# Altium project FLETCHER v2.PrjPcb
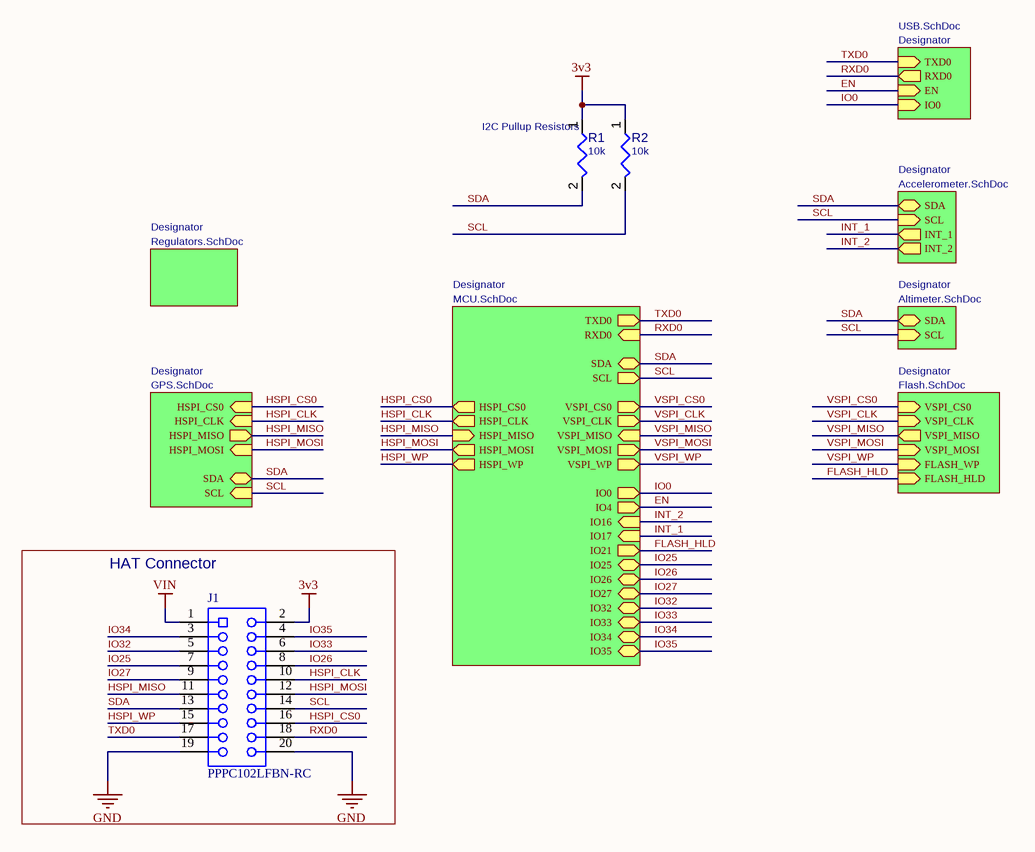
[diagram p0: Top Level.SchDoc]
CAGE_CODE: ?????; CONTRACT_NUMBER: <CONTRACT NO>; DOC_NO_ASSY_DWG: <ASSY DWG NO>; DOC_NO_BOM: <BOM DOC NO>; DOC_NO_FAB_DWG: <FAB DWG NO>; DOC_NO_SCH_DWG: <SCH DWG NO>; PCB_2_DEC_TOL: +/-.01; PCB_3_DEC_TOL: +/-.010; PCB_ANG_TOL: +/-1/2; PCB_ASSEMBLY_NO: <PCB ASSY NO>; PCB_CHECKER: - -----; PCB_CHECKER_APP_DATE: --/--/----; PCB_DESIGNER: - -----; PCB_DESIGNER_APP_DATE: --/--/----; PCB_DWG_NO: <PCB DWG NO>; PCB_ENGINEER: - -----; PCB_ENGINEER_APP_DATE: --/--/----; PCB_PART_NUMBER: <PCB PN>; PCB_REV: A; SCH_REV: A
8 sheets, 83 parts. Net scope: hierarchical (ports join the sheet entries above them; power ports are global).
Board file: PCB1.PcbDoc
Sheets:
  Top Level.SchDoc
    Designator = USB.SchDoc
    Designator = Flash.SchDoc
    Designator = MCU.SchDoc
    Designator = Accelerometer.SchDoc
    Designator = GPS.SchDoc
    Designator = Altimeter.SchDoc
    Designator = Regulators.SchDoc

## Sheet Top Level.SchDoc
size B; SheetNumber: 1; SheetTotal: 8

### Parts
J1  PPPC102LFBN-RC  [SLIN-PPPC102LFBN-RC_V]
R1  value 10k  [RESC0402(1005)_L]  (hidden comment: Resistor 10K  +/-1 % 0402 63 mW)
R2  value 10k  [RESC0402(1005)_L]  (hidden comment: Resistor 10K  +/-1 % 0402 63 mW)

### Blocks framed on the sheet
HAT Connector: J1

### Sub-sheets
Designator = USB.SchDoc: TXD0 (in), RXD0 (out), EN (in), IO0 (in)
Designator = Flash.SchDoc: VSPI_CS0 (in), VSPI_CLK (in), FLASH_HLD (in), VSPI_MISO (out), VSPI_MOSI (in), FLASH_WP (in)
Designator = MCU.SchDoc: TXD0 (out), RXD0 (in), SDA (bidir), SCL (out), VSPI_CS0 (out), VSPI_CLK (out), VSPI_MISO (in), VSPI_MOSI (out), VSPI_WP (out), HSPI_WP (out), HSPI_CLK (out), HSPI_CS0 (out), HSPI_MISO (in), HSPI_MOSI (out), IO0 (out), IO4 (out), IO16 (in), IO17 (in), IO21 (out), IO25 (bidir), IO26 (bidir), IO27 (bidir), IO32 (bidir), IO33 (bidir), IO34 (bidir), IO35 (bidir)
Designator = Accelerometer.SchDoc: SDA (bidir), SCL (in), INT_1 (out), INT_2 (out)
Designator = GPS.SchDoc: HSPI_CS0 (in), HSPI_CLK (in), HSPI_MISO (out), HSPI_MOSI (in), SDA (bidir), SCL (in)
Designator = Altimeter.SchDoc: SDA (bidir), SCL (in)
Designator = Regulators.SchDoc: no entries

### Nets
3v3: J1.2 R1.1 R2.1
GND: J1.19 J1.20
VIN: J1.1
EN: sheet Designator/EN, sheet Designator/IO4
FLASH_HLD: sheet Designator/FLASH_HLD, sheet Designator/IO21
HSPI_CLK: J1.10 ; sheet Designator/HSPI_CLK, sheet Designator/HSPI_CLK
HSPI_CS0: J1.16 ; sheet Designator/HSPI_CS0, sheet Designator/HSPI_CS0
HSPI_MISO: J1.11 ; sheet Designator/HSPI_MISO, sheet Designator/HSPI_MISO
HSPI_MOSI: J1.12 ; sheet Designator/HSPI_MOSI, sheet Designator/HSPI_MOSI
HSPI_WP: J1.15 ; sheet Designator/HSPI_WP
INT_1: sheet Designator/IO17, sheet Designator/INT_1
INT_2: sheet Designator/IO16, sheet Designator/INT_2
IO0: sheet Designator/IO0, sheet Designator/IO0
IO25: J1.7 ; sheet Designator/IO25
IO26: J1.8 ; sheet Designator/IO26
IO27: J1.9 ; sheet Designator/IO27
IO32: J1.5 ; sheet Designator/IO32
IO33: J1.6 ; sheet Designator/IO33
IO34: J1.3 ; sheet Designator/IO34
IO35: J1.4 ; sheet Designator/IO35
RXD0: J1.18 ; sheet Designator/RXD0, sheet Designator/RXD0
SCL: J1.14 R2.2 ; sheet Designator/SCL, sheet Designator/SCL, sheet Designator/SCL, sheet Designator/SCL
SDA: J1.13 R1.2 ; sheet Designator/SDA, sheet Designator/SDA, sheet Designator/SDA, sheet Designator/SDA
TXD0: J1.17 ; sheet Designator/TXD0, sheet Designator/TXD0
VSPI_CLK: sheet Designator/VSPI_CLK, sheet Designator/VSPI_CLK
VSPI_CS0: sheet Designator/VSPI_CS0, sheet Designator/VSPI_CS0
VSPI_MISO: sheet Designator/VSPI_MISO, sheet Designator/VSPI_MISO
VSPI_MOSI: sheet Designator/VSPI_MOSI, sheet Designator/VSPI_MOSI
VSPI_WP: sheet Designator/FLASH_WP, sheet Designator/VSPI_WP

### Notes on the sheet
- (near R1) I2C Pullup Resistors

### Library data of the parts
J1 = CMP-002-00029-1: Female Header, Pitch 2.54 mm, 2 x 10 Position, Height 8.75 mm, Tail Length 3.2 mm, -40 to 105 degC, RoHS, Bulk; Manufacturer: Sullins; Mounting Technology: TH; Gender: Female; Datasheet URL: http://datasheet.octopart.com/PPPC102LFBN-RC-Sullins-datasheet-8327184.pdf; Max Operating Temperature: 105°C; Package Description: Female Header, Pitch 2.54 mm, 2 x 10 Position, Height 8.75 mm, Tail Length 3.2 mm; Min Operating Temperature: -40°C; Datasheet Version: Rev. D, 10/2007; Case/Package: PPPC102LFBN-RC; Connector Type: Header; RoHS Compliant: Unknown; Package Reference: PPPC102LFBN-RC
R1 R2 = CMP-009-00149-2: Chip Resistor, 10 kOhms, +/-1 %, 63 mW, -55 to 125 degC, 0402; Power: 63mW; Tolerance: 1%; Pins: 2; Max Operating Temperature: 155°C; Min Operating Temperature: -55°C; Case/Package: 0402
  R1: JLCPCB Part #: C25744

## Sheet USB.SchDoc
size B; SheetNumber: 3; SheetTotal: 8
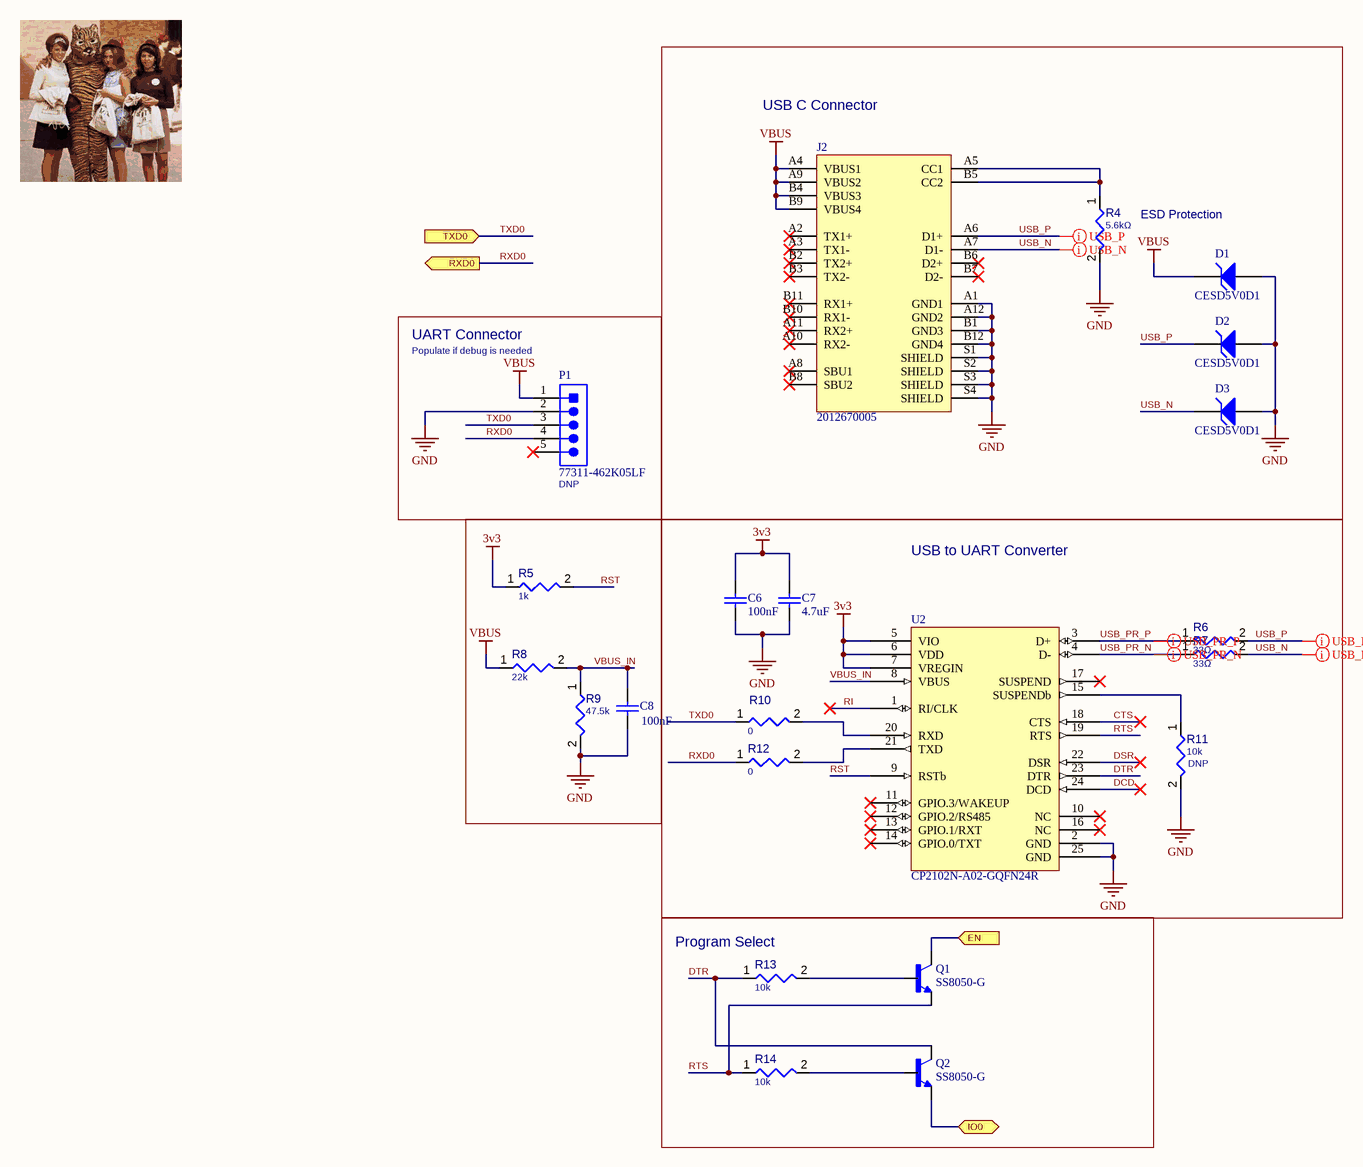
[diagram p1: USB.SchDoc]

### Parts
C6  Capacitance: 100nF  [Capacitor_0402]  (hidden comment: GRM155R71E104KE14D)
C7  Capacitance: 4.7uF  [Capacitor_0402]  (hidden comment: GRM155R60J475ME87D)
C8  Capacitance: 100nF  [Capacitor_0402]  (hidden comment: GRM155R71E104KE14D)
D1  CESD5V0D1  [JSCJ-SOD-123-2_V]
D2  CESD5V0D1  [JSCJ-SOD-123-2_V]
D3  CESD5V0D1  [JSCJ-SOD-123-2_V]
J2  2012670005  [2012670005-Footprint-1]
P1  77311-462K05LF  [FCI-77311-5_V]
Q1  SS8050-G  [SS8050-G-Footprint-1]
Q2  SS8050-G  [SS8050-G-Footprint-1]
R4  value 5.6kΩ  [RESC0402(1005)_L]  (hidden comment: 5D6KR2J)
R5  value 1k  [RESC0402(1005)_L]  (hidden comment: Resistor 1K +/-5 % 0402 63 mW)
R6  value 33Ω  [RESC0402(1005)_L]  (hidden comment: 33R2J)
R7  value 33Ω  [RESC0402(1005)_L]  (hidden comment: 33R2J)
R8  value 22k  [RESC0402(1005)_L]  (hidden comment: Resistor 22K  +/-1 % 0402 63 mW)
R9  value 47.5k  [RESC0402(1005)_L]  (hidden comment: Resistor 47K5 +/-1 % 0402 63 mW)
R10  value 0  [RESC0402(1005)_L]  (hidden comment: Jumper 0402)
R11  value 10k  [RESC0402(1005)_L]  (hidden comment: Resistor 10K  +/-1 % 0402 63 mW)
R12  value 0  [RESC0402(1005)_L]  (hidden comment: Jumper 0402)
R13  value 10k  [RESC0402(1005)_L]  (hidden comment: Resistor 10K  +/-1 % 0402 63 mW)
R14  value 10k  [RESC0402(1005)_L]  (hidden comment: Resistor 10K  +/-1 % 0402 63 mW)
U2  CP2102N-A02-GQFN24R  [CP2102N-A02-GQFN24R-Footprint-1]

### Blocks framed on the sheet
USB C Connector: D1-D3 J2 R4
UART Connector: P1
USB to UART Converter: C6 C7 R6 R7 R10-R12 U2
Program Select: Q1 Q2 R13 R14

### Ports
EN (in), IO0 (bidir), RXD0 (out), TXD0 (in)

### Nets
3v3: C6.2 C7.2 R5.1 U2.5(VIO) U2.6(VDD) U2.7(VREGIN)
GND: C6.1 C7.1 C8.1 D1.1(A) D2.1(A) D3.1(A) J2.A1(GND1) J2.A12(GND2) J2.B1(GND3) J2.B12(GND4) J2.S1(SHIELD) J2.S2(SHIELD) J2.S3(SHIELD) J2.S4(SHIELD) P1.2(RXI) R4.2 R9.2 R11.2 U2.2(GND) U2.25(GND)
VBUS: D1.2(K) J2.A4(VBUS1) J2.A9(VBUS2) J2.B4(VBUS3) J2.B9(VBUS4) P1.1(DTR) R8.1
CTS: U2.18(CTS)
DCD: U2.24(DCD)
DSR: U2.22(DSR)
DTR: Q2.3(C) R13.1 U2.23(DTR)
EN: Q1.3(C) ; port EN
IO0: Q2.2(E) ; port IO0
RI: U2.1(RI/CLK)
RST: R5.2 U2.9(RSTb)
RTS: Q1.2(E) R14.1 U2.19(RTS)
RXD0: P1.4(VCC) R12.1 ; port RXD0
TXD0: P1.3(TXO) R10.1 ; port TXD0
USB_N: D3.2(K) J2.A7(D1-) R7.2
USB_P: D2.2(K) J2.A6(D1+) R6.2
USB_PR_N: R7.1 U2.4(D-)
USB_PR_P: R6.1 U2.3(D+)
VBUS_IN: C8.2 R8.2 R9.1 U2.8(VBUS)
NetJ2_A5: J2.A5(CC1) J2.B5(CC2) R4.1
NetQ1_1: Q1.1(B) R13.2
NetQ2_1: Q2.1(B) R14.2
NetR10_2: R10.2 U2.20(RXD)
NetR11_1: R11.1 U2.15(SUSPENDb)
NetR12_2: R12.2 U2.21(TXD)

Not connected (* = marked no-connect by the designer): J2 A2(TX1+)* A3(TX1-)* A8(SBU1)* A10(RX2-)* A11(RX2+)* B2(TX2+)* B3(TX2-)* B6(D2+)* B7(D2-)* B8(SBU2)* B10(RX1-)* B11(RX1+)*; P1 5(CTS)*; U2 10(NC)* 11(GPIO.3/WAKEUP)* 12(GPIO.2/RS485)* 13(GPIO.1/RXT)* 14(GPIO.0/TXT)* 16(NC)* 17(SUSPEND)*

### Layout directives
differential pair; net class USB: USB_N, USB_P, USB_PR_N, USB_PR_P

### Notes on the sheet
- ESD Protection
- (near P1) Populate if debug is needed

### Library data of the parts
C6 C8 = CMP-001-00084-3: Chip Capacitor 100nF 0402 25V X7R
C7 = CMP-00000-1: 6.3V 4.7uF X5R ±20% 0402 Multilayer Ceramic Capacitors MLCC - SMD/SMT ROHS; Thickness: 0.022inch; Min Operating Temperature: -55°C; Case Code (Metric): 1005; Depth: 0.5mm; Tolerance: 20%; Width: 0.02inch; Series: GRM; Length: 1mm; Height: 0.5mm; Lead Free: Lead Free; Dielectric: X5R; Construction: Flat; REACH SVHC: No SVHC; Mount: Surface Mount; Radiation Hardening: No; Voltage Rating: 6.3V; RoHS Compliant: Yes; Packaging: Tape and Reel; Voltage Rating (DC): 6.3V; Package Quantity: 1; Max Operating Temperature: 85°C; Case Code (Imperial): 0402; JLCPCB Part #: C23733
D1-D3 = CMP-004-00020-1: Uni-driection ESD Protection Diode, 5 V, 1 uA, 2-Pin SOD-123, RoHS, Tape and Reel; Manufacturer: Jiangsu Changjiang Electronics Technology; Mounting Technology: SM; Case/Package: SOD-123-2; Package Description: 2-Pin Surface Mount Device, Body 2.7 x 1.6 mm; Package Reference: SOD-123-2; RoHS Compliant: Unknown; Package URL: http://www.cj-elec.com/txUpfile/201412112231195145.pdf; Datasheet URL: http://www.cj-elec.com/gallery/txUpfile/f05a5831e2d7f622a930855050fbe076.pdf; Datasheet Version: Rev. B, 04/2014
  D1: JLCPCB Part #: C85649
J2 = CMP-002-00076-2: Conn USB 3.1 Type C F 24 POS 0.5mm Solder RA SMD 24 Terminal 1 Port T/R; JLCPCB Part #: C565324
P1 = CMP-002-00021-1: Male Header, Pitch 2.54 mm, 1 x 5 Position, Height 16.24 mm, Tail Length 3.05 mm, -65 to 125 degC, RoHS, Tape and Reel; Manufacturer: FCI Electronics; Gender: Male; Mounting Technology: TH; Connector Type: Header; Package Reference: 77311-5; Case/Package: 77311-5; RoHS Compliant: Unknown; Datasheet URL: http://portal.fciconnect.com/Comergent//fci/drawing/77311.pdf; Manufacturer URL: http://portal.fciconnect.com/; Package Description: Male Header, Pitch 2.54 mm, 1 x 5 Position, Height 16.24 mm, Tail Length 3.05 mm; Datasheet Version: Rev. CK, 07/2016; DNP: DNP
Q1 Q2 = CMP-013-00035-1: Trans Gp Bjt NPN 25V 1.5A 300MW 3-PIN SOT-23 T/r
  Q1: JLCPCB Part #: C2150
R4 = CMP-009-00108-1: 5K6 0.063W 5% 0402 (1005 Metric)  SMD; Power: 63mW; Mounting Technology: SMT; Pins: 2; Tolerance: 5%; Case/Package: 0402; JLCPCB Part #: C25908
R5 = CMP-009-00157-2: Chip Resistor, 1 kOhms, +/-5 %, 63 mW, -55 to 155 degC, 0402; Power: 63mW; Tolerance: 5%; Min Operating Temperature: -55°C; Max Operating Temperature: 155°C; Pins: 2; Case/Package: 0402; JLCPCB Part #: C11702
R6 R7 = CMP-009-00096-1: 33R 0.063W 5% 0402 (1005 Metric)  SMD; Power: 63mW; Tolerance: 5%; Mounting Technology: SMT; Pins: 2; Case/Package: 0402
  R6: JLCPCB Part #: C25105
R8 = CMP-009-00123-2: Chip Resistor, 22 kOhms, +/-1 %, 63 mW, -55 to 155 degC, 0402; Power: 63mW; Tolerance: 1%; Min Operating Temperature: -55°C; Max Operating Temperature: 155°C; Pins: 2; Case/Package: 0402; JLCPCB Part #: C25768
R9 = CMP-009-00137-2: Chip Resistor, 47,5 kOhms, +/-1 %, 63 mW, -55 to 155 degC, 0402; Tolerance: 1%; Power: 63mW; Pins: 2; Case/Package: 0402; Max Operating Temperature: 155°C; Min Operating Temperature: -55°C; JLCPCB Part #: C227098
R10 R12 = CMP-009-00148-2: Max Operating Temperature: 155°C; Pins: 2; Case/Package: 0402; Min Operating Temperature: -55°C
  R10: JLCPCB Part #: C17168
R11 R13 R14 = CMP-009-00149-2: as R1 on sheet Top Level; Pins: 2; Max Operating Temperature: 155°C; Min Operating Temperature: -55°C; Case/Package: 0402
  R11: DNP: DNP
U2 = CMP-002-00074-1: Full Speed USB to UART Bridge USB 2.0 3.3V T/R Automotive 24-Pin QFN EP

## Sheet Flash.SchDoc
size B; SheetNumber: 4; SheetTotal: 8
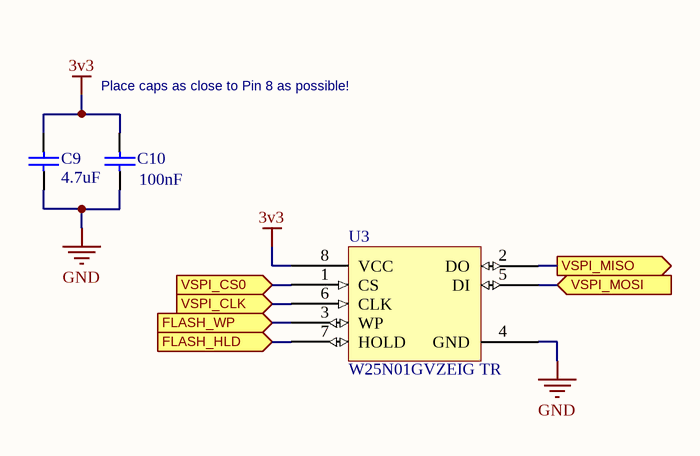
[diagram p2: Flash.SchDoc]

### Parts
C9  Capacitance: 4.7uF  [Capacitor_0402]  (hidden comment: GRM155R60J475ME87D)
C10  Capacitance: 100nF  [Capacitor_0402]  (hidden comment: GRM155R71E104KE14D)
U3  W25N01GVZEIG TR  [W25N01GVZEIG TR-Footprint-1]

### Ports
FLASH_HLD (in), FLASH_WP (in), VSPI_CLK (in), VSPI_CS0 (in), VSPI_MISO (out), VSPI_MOSI (in)

### Nets
3v3: C9.2 C10.2 U3.8(VCC)
GND: C9.1 C10.1 U3.4(GND)
FLASH_HLD: U3.7(HOLD) ; port FLASH_HLD
VSPI_CLK: U3.6(CLK) ; port VSPI_CLK
VSPI_CS0: U3.1(CS) ; port VSPI_CS0
VSPI_MISO: U3.2(DO) ; port VSPI_MISO
VSPI_MOSI: U3.5(DI) ; port VSPI_MOSI
VSPI_WP: U3.3(WP) ; port FLASH_WP

### Notes on the sheet
- Place caps as close to Pin 8 as possible!

### Library data of the parts
C9 = CMP-00000-1: as C7 on sheet USB; Thickness: 0.022inch; Min Operating Temperature: -55°C; Case Code (Metric): 1005; Depth: 0.5mm; Tolerance: 20%; Width: 0.02inch; Series: GRM; Length: 1mm; Height: 0.5mm; Lead Free: Lead Free; Dielectric: X5R; Construction: Flat; REACH SVHC: No SVHC; Mount: Surface Mount; Radiation Hardening: No; Voltage Rating: 6.3V; RoHS Compliant: Yes; Packaging: Tape and Reel; Voltage Rating (DC): 6.3V; Package Quantity: 1; Max Operating Temperature: 85°C; Case Code (Imperial): 0402
C10 = CMP-001-00084-3: Chip Capacitor 100nF 0402 25V X7R
U3 = CMP-010-00028-1: 1Gb NAND Flash Memory With dual/Quad SPI And Continuous Read

## Sheet MCU.SchDoc
size B; SheetNumber: 2; SheetTotal: 8
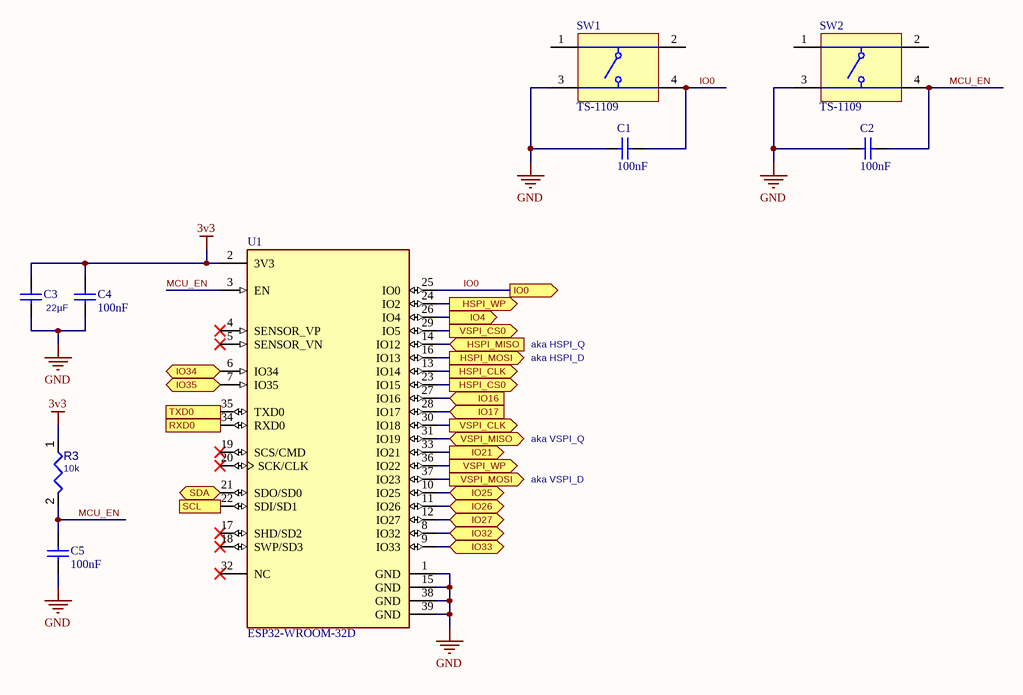
[diagram p3: MCU.SchDoc]

### Parts
C1  Capacitance: 100nF  [Capacitor_0402]  (hidden comment: GRM155R71E104KE14D)
C2  Capacitance: 100nF  [Capacitor_0402]  (hidden comment: GRM155R71E104KE14D)
C3  value 22µF  [Capacitor_0603]  (hidden comment: CL10A226MQ8NRNC)
C4  Capacitance: 100nF  [Capacitor_0402]  (hidden comment: GRM155R71E104KE14D)
C5  Capacitance: 100nF  [Capacitor_0402]  (hidden comment: GRM155R71E104KE14D)
R3  value 10k  [RESC0402(1005)_L]  (hidden comment: Resistor 10K  +/-1 % 0402 63 mW)
SW1  TS-1109  [BEST-TS-1109_V]
SW2  TS-1109  [BEST-TS-1109_V]
U1  ESP32-WROOM-32D  [ESP32-WROOM-32D-Footprint-1]

### Ports
HSPI_CLK (out), HSPI_CS0 (out), HSPI_MISO (in), HSPI_MOSI (out), HSPI_WP (out), IO0 (out), IO4 (out), IO16 (in), IO17 (in), IO21 (out), IO25 (bidir), IO26 (bidir), IO27 (bidir), IO32 (bidir), IO33 (bidir), IO34 (bidir), IO35 (bidir), RXD0 (in), SCL (out), SDA (bidir), TXD0 (out), VSPI_CLK (out), VSPI_CS0 (out), VSPI_MISO (bidir), VSPI_MOSI (out), VSPI_WP (out)

### Nets
3v3: C3.2 C4.2 R3.1 U1.2(3V3)
GND: C1.2 C2.2 C3.1 C4.1 C5.1 SW1.3 SW2.3 U1.1(GND) U1.15(GND) U1.38(GND) U1.39(GND)
EN: U1.26(IO4) ; port IO4
FLASH_HLD: U1.33(IO21) ; port IO21
HSPI_CLK: U1.13(IO14) ; port HSPI_CLK
HSPI_CS0: U1.23(IO15) ; port HSPI_CS0
HSPI_MISO: U1.14(IO12) ; port HSPI_MISO
HSPI_MOSI: U1.16(IO13) ; port HSPI_MOSI
HSPI_WP: U1.24(IO2) ; port HSPI_WP
INT_1: U1.28(IO17) ; port IO17
INT_2: U1.27(IO16) ; port IO16
IO0: C1.1 SW1.4 U1.25(IO0) ; port IO0
IO25: U1.10(IO25) ; port IO25
IO26: U1.11(IO26) ; port IO26
IO27: U1.12(IO27) ; port IO27
IO32: U1.8(IO32) ; port IO32
IO33: U1.9(IO33) ; port IO33
IO34: U1.6(IO34) ; port IO34
IO35: U1.7(IO35) ; port IO35
MCU_EN: C2.1 C5.2 R3.2 SW2.4 U1.3(EN)
RXD0: U1.34(RXD0) ; port RXD0
SCL: U1.22(SDI/SD1) ; port SCL
SDA: U1.21(SDO/SD0) ; port SDA
TXD0: U1.35(TXD0) ; port TXD0
VSPI_CLK: U1.30(IO18) ; port VSPI_CLK
VSPI_CS0: U1.29(IO5) ; port VSPI_CS0
VSPI_MISO: U1.31(IO19) ; port VSPI_MISO
VSPI_MOSI: U1.37(IO23) ; port VSPI_MOSI
VSPI_WP: U1.36(IO22) ; port VSPI_WP

Not connected (* = marked no-connect by the designer): SW1 1 2; SW2 1 2; U1 4(SENSOR_VP)* 5(SENSOR_VN)* 17(SHD/SD2)* 18(SWP/SD3)* 19(SCS/CMD)* 20(SCK/CLK)* 32(NC)*

### Notes on the sheet
- aka HSPI_Q
- aka HSPI_D
- aka VSPI_Q
- aka VSPI_D

### Library data of the parts
C1 C2 C4 C5 = CMP-001-00084-3: Chip Capacitor 100nF 0402 25V X7R
  C1: JLCPCB Part #: C1525
C3 = CMP-001-00086-2: Chip Capacitor 22UF 6.3V X5R 0603; Footprint: 0603; JLCPCB Part #: C59461
R3 = CMP-009-00149-2: as R1 on sheet Top Level; Pins: 2; Max Operating Temperature: 155°C; Min Operating Temperature: -55°C; Case/Package: 0402
SW1 SW2 = CMP-011-00002-2: Tactile Switch, SPST, 12 V, 50 mA, -20 to 80 degC, 4-Pin THD; Manufacturer: Shenzhen Best; Datasheet URL: http://datasheet.octopart.com/TS-1109-Best-Inc.-datasheet-30458100.pdf; RoHS Compliant: Unknown; Case/Package: TS-1109; Datasheet Version: Dec-12; Package Reference: TS-1109; Package Description: 4-Pin Through Hole Device, Body 6.2 x 6.2 mm; Manufacturer URL: www.best-dz.com/; Mounting Technology: TH
U1 = CMP-020-00023-1: Bluetooth, WiFi 802.11b/g/n, Bluetooth v4.2 + EDR, Class 1, 2 and 3 Transceiver Module 2.4GHz ~ 2.5GHz Integrated, Trace Surface Mount

## Sheet Accelerometer.SchDoc
size B; SheetNumber: 6; SheetTotal: 8
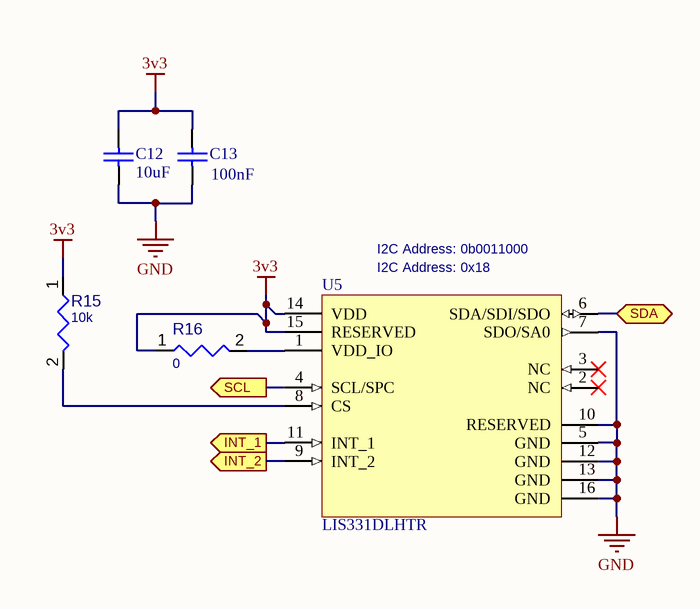
[diagram p4: Accelerometer.SchDoc]

### Parts
C12  Capacitance: 10uF  [Capacitor_0402]  (hidden comment: GRM155R60J106ME44D)
C13  Capacitance: 100nF  [Capacitor_0402]  (hidden comment: GRM155R71E104KE14D)
R15  value 10k  [RESC0402(1005)_L]  (hidden comment: Resistor 10K  +/-1 % 0402 63 mW)
R16  value 0  [RESC0402(1005)_L]  (hidden comment: Jumper 0402)
U5  LIS331DLHTR  [STM-LGA16-3X3X1]

### Ports
INT_1 (out), INT_2 (out), SCL (out), SDA (bidir)

### Nets
3v3: C12.2 C13.2 R15.1 R16.1 U5.14(VDD) U5.15(RESERVED)
GND: C12.1 C13.1 U5.5(GND) U5.7(SDO/SA0) U5.10(RESERVED) U5.12(GND) U5.13(GND) U5.16(GND)
INT_1: U5.11(INT_1) ; port INT_1
INT_2: U5.9(INT_2) ; port INT_2
SCL: U5.4(SCL/SPC) ; port SCL
SDA: U5.6(SDA/SDI/SDO) ; port SDA
NetR15_2: R15.2 U5.8(CS)
NetR16_2: R16.2 U5.1(VDD_IO)

Not connected (* = marked no-connect by the designer): U5 2(NC)* 3(NC)*

### Notes on the sheet
- (near U5) I2C Address: 0b0011000
- (near U5) I2C Address: 0x18

### Library data of the parts
C12 = CMP-00003-1: CAP CER 10UF 6.3V X5R 0402; Tolerance: 20%; Lead Free: Lead Free; Height: 0.5mm; Depth: 0.5mm; Voltage Rating (DC): 6.3V; Case Code (Imperial): 0402; Termination: SMD/SMT; Series: GRM; Case Code (Metric): 1005; Min Operating Temperature: -55°C; Max Operating Temperature: 85°C; RoHS Compliant: Yes; Width: 0.02inch; Voltage Rating: 6.3V; Length: 1mm; Package Quantity: 10000; Thickness: 0.022inch; Packaging: Tape and Reel; Mount: Surface Mount; Dielectric: X5R; REACH SVHC: No SVHC; JLCPCB Part #: C15525
C13 = CMP-001-00084-3: Chip Capacitor 100nF 0402 25V X7R
R15 = CMP-009-00149-2: as R1 on sheet Top Level; Pins: 2; Max Operating Temperature: 155°C; Min Operating Temperature: -55°C; Case/Package: 0402
R16 = CMP-009-00148-2: Max Operating Temperature: 155°C; Pins: 2; Case/Package: 0402; Min Operating Temperature: -55°C
U5 = CMP-010-00030-1: LIS331DLH Series 3 Axis ±2/±4/±8 g 3.6V Digital Output Nano Accelerometer LGA-16

## Sheet GPS.SchDoc
size B; SheetNumber: 7; SheetTotal: 8
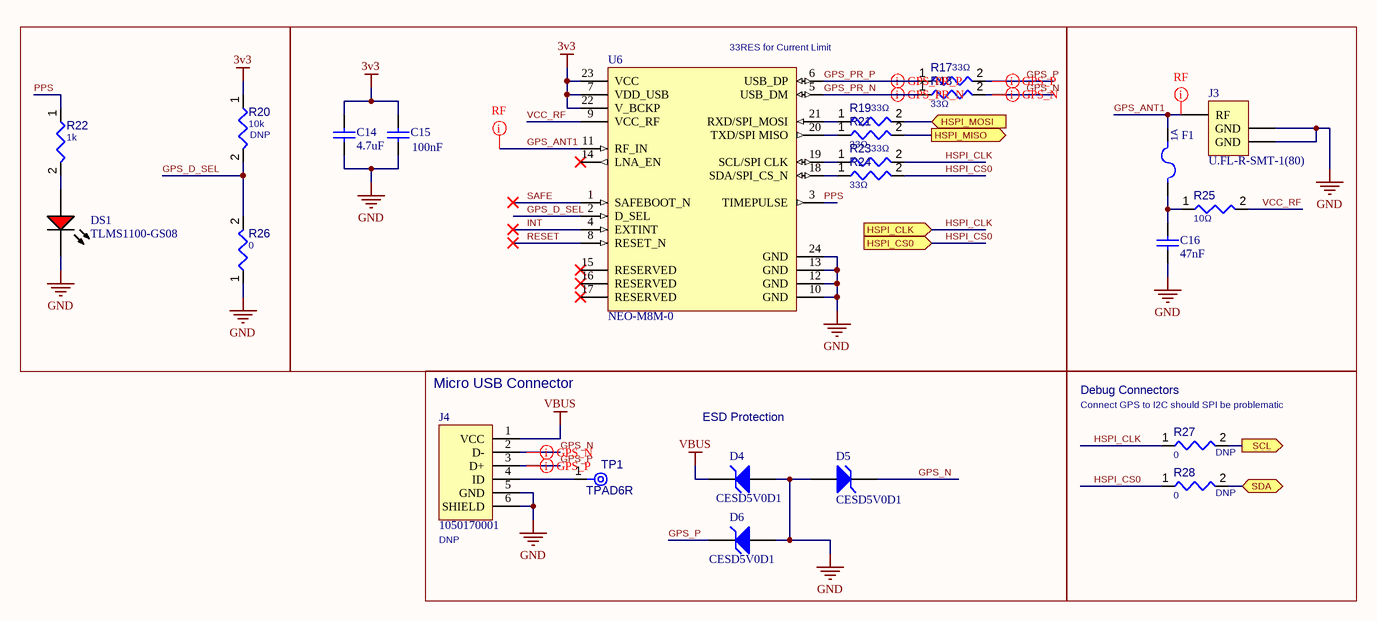
[diagram p5: GPS.SchDoc]

### Parts
C14  Capacitance: 4.7uF  [Capacitor_0402]  (hidden comment: GRM155R60J475ME87D)
C15  Capacitance: 100nF  [Capacitor_0402]  (hidden comment: GRM155R71E104KE14D)
C16  Capacitance: 47nF  [Capacitor_0402]  (hidden comment: GCM155R71H473KE02J)
D4  CESD5V0D1  [JSCJ-SOD-123-2_V]
D5  CESD5V0D1  [JSCJ-SOD-123-2_V]
D6  CESD5V0D1  [JSCJ-SOD-123-2_V]
DS1  TLMS1100-GS08  [VISH-TLMX1100_V]
F1  0466001.NRHF  [FP-0466-MFG]  (value not drawn)
J3  U.FL-R-SMT-1(80)  [FP-U_FL-R-SMT-1_80-MFG]
J4  1050170001  [1050170001-Footprint-1]
R17  value 33Ω  [RESC0402(1005)_L]  (hidden comment: 33R2J)
R18  value 33Ω  [RESC0402(1005)_L]  (hidden comment: 33R2J)
R19  value 33Ω  [RESC0402(1005)_L]  (hidden comment: 33R2J)
R20  value 10k  [RESC0402(1005)_L]  (hidden comment: Resistor 10K  +/-1 % 0402 63 mW)
R21  value 33Ω  [RESC0402(1005)_L]  (hidden comment: 33R2J)
R22  value 1k  [RESC0402(1005)_L]  (hidden comment: Resistor 1K +/-5 % 0402 63 mW)
R23  value 33Ω  [RESC0402(1005)_L]  (hidden comment: 33R2J)
R24  value 33Ω  [RESC0402(1005)_L]  (hidden comment: 33R2J)
R25  value 10Ω  [RESC0402(1005)_L]  (hidden comment: 10R2F)
R26  value 0  [RESC0402(1005)_L]  (hidden comment: Jumper 0402)
R27  value 0  [RESC0402(1005)_L]  (hidden comment: Jumper 0402)
R28  value 0  [RESC0402(1005)_L]  (hidden comment: Jumper 0402)
TP1  TPAD6R  [TP06R]  (no BOM)
U6  NEO-M8M-0  [NEO-M8M-0-Footprint-1]

### Blocks framed on the sheet
33RES for Current Limit: C14 C15 R17-R19 R21 R23 R24 U6
Micro USB Connector: D4-D6 J4 TP1
Debug Connectors: R27 R28

### Ports
HSPI_CLK (in), HSPI_CS0 (in), HSPI_MISO (out), HSPI_MOSI (in), SCL (out), SDA (bidir)

### Nets
3v3: C14.2 C15.2 R20.1 U6.7(VDD_USB) U6.22(V_BCKP) U6.23(VCC)
GND: C14.1 C15.1 C16.1 D4.1(A) D5.1(A) D6.1(A) DS1.2(K) J3.2(GND) J3.3(GND) J4.5(GND) J4.6(SHIELD) R26.1 U6.10(GND) U6.12(GND) U6.13(GND) U6.24(GND)
VBUS: D4.2(K) J4.1(VCC)
GPS_ANT1: F1.2 J3.1(RF) U6.11(RF_IN)
GPS_D_SEL: R20.2 R26.2 U6.2(D_SEL)
GPS_N: D5.2(K) J4.2(D-) R18.2
GPS_P: D6.2(K) J4.3(D+) R17.2
GPS_PR_N: R18.1 U6.5(USB_DM)
GPS_PR_P: R17.1 U6.6(USB_DP)
HSPI_CLK: R23.2 R27.1 ; port HSPI_CLK
HSPI_CS0: R24.2 R28.1 ; port HSPI_CS0
HSPI_MISO: R21.2 ; port HSPI_MISO
HSPI_MOSI: R19.2 ; port HSPI_MOSI
INT: U6.4(EXTINT)
PPS: R22.1 U6.3(TIMEPULSE)
RESET: U6.8(RESET_N)
SAFE: U6.1(SAFEBOOT_N)
SCL: R27.2 ; port SCL
SDA: R28.2 ; port SDA
VCC_RF: R25.2 U6.9(VCC_RF)
NetC16_2: C16.2 F1.1 R25.1
NetDS1_1: DS1.1(A) R22.2
NetJ4_4: J4.4(ID) TP1.1(TP)
NetR19_1: R19.1 U6.21(RXD/SPI_MOSI)
NetR21_1: R21.1 U6.20(TXD/SPI_MISO)
NetR23_1: R23.1 U6.19(SCL/SPI_CLK)
NetR24_1: R24.1 U6.18(SDA/SPI_CS_N)

Not connected (* = marked no-connect by the designer): U6 14(LNA_EN)* 15(RESERVED)* 16(RESERVED)* 17(RESERVED)*

### Layout directives
differential pair; net class USB: GPS_N, GPS_P, GPS_PR_N, GPS_PR_P
net class RF: GPS_ANT1

### Notes on the sheet
- ESD Protection
- (near R27) Connect GPS to I2C should SPI be problematic

### Library data of the parts
C14 = CMP-00000-1: as C7 on sheet USB; Thickness: 0.022inch; Min Operating Temperature: -55°C; Case Code (Metric): 1005; Depth: 0.5mm; Tolerance: 20%; Width: 0.02inch; Series: GRM; Length: 1mm; Height: 0.5mm; Lead Free: Lead Free; Dielectric: X5R; Construction: Flat; REACH SVHC: No SVHC; Mount: Surface Mount; Radiation Hardening: No; Voltage Rating: 6.3V; RoHS Compliant: Yes; Packaging: Tape and Reel; Voltage Rating (DC): 6.3V; Package Quantity: 1; Max Operating Temperature: 85°C; Case Code (Imperial): 0402
C15 = CMP-001-00084-3: Chip Capacitor 100nF 0402 25V X7R
C16 = CMP-001-00085-1: Cap Ceramic 47nF 50V X7R 10% Pad SMD 0402 125C Automotive T/R; JLCPCB Part #: C697422
D4-D6 = CMP-004-00020-1: as D1 on sheet USB; Mounting Technology: SM; Case/Package: SOD-123-2; Package Description: 2-Pin Surface Mount Device, Body 2.7 x 1.6 mm; Package Reference: SOD-123-2; RoHS Compliant: Unknown; Package URL: http://www.cj-elec.com/txUpfile/201412112231195145.pdf; Datasheet URL: http://www.cj-elec.com/gallery/txUpfile/f05a5831e2d7f622a930855050fbe076.pdf; Datasheet Version: Rev. B, 04/2014
DS1 = CMP-007-00030-1: Red Led, 20mA, 2.1 V, -40 to 100 degC, 2-Pin SMD (0603), RoHS, Tape and Reel; Manufacturer: Vishay Semiconductor; Forward Voltage: 2.1V; Lens Style: Clear; Luminous Intensity: 63mcd; Power: 90mW; Viewing Angle: 160degrees; Datasheet Version: Rev. 2.7, 03/2016; Package Reference: TLMX1100; Packaging: TapeandReel; Mounting Technology: SM; Illumination Colour: Red; Min Operating Temperature: -40°C; Case/Package: 0603; RoHS Compliant: True; Pins: 2; Max Operating Temperature: 100°C; Datasheet URL: http://www.vishay.com/docs/83173/tlmb1100.pdf; Package Description: 2-Pin Surface Mount Device, Body 1.6 x 0.8 mm; Manufacturer URL: http://www.vishay.com/; Nominal Vf: 2.1V; Colour: Red; Package Quantity: 3000; Forward Current: 20mA; JLCPCB Part #: C2286
F1 = CMP-007-00037-2: Fuse Chip Very Fast Acting 1A 63V SMD Solder Pad 1206 T/R CSA; Value: 1A; JLCPCB Part #: C151135
J3 = CMP-001-0231-3: CONN U.FL RCPT STR 50 OHM SMD; Impedance: 50R; Body Plating: Silver; Number of Ports: 1; Max Frequency: 6GHz; Mating Cycles: 30; Connector Type: Receptacle,Male Pin; Center Contact Plating: Gold; Dielectric Material: Polymer; Body Material: Bronze; Package Quantity: 10000; Max Operating Temperature: 90°C; Case/Package: SMD/SMT; Min Operating Temperature: -40°C; Packaging: Tape and Reel; Fastening Type: SNAP-ON; Series: U.FL; Contact Material: Brass; Mount: Surface Mount; RoHS Compliant: Yes; Termination: Solder; Lead Free: Lead Free; Housing Color: Beige; JLCPCB Part #: C88374
J4 = CMP-002-00075-1: Micro USB Connector; Data Recept.; Micro; B Type; Bottom Mount, SMT, with Solder Tabs, Lead-Free; DNP: DNP; JLCPCB Part #: C136000
R17-R19 R21 R23 R24 = CMP-009-00096-1: as R6 on sheet USB; Tolerance: 5%; Mounting Technology: SMT; Pins: 2; Case/Package: 0402
R20 = CMP-009-00149-2: as R1 on sheet Top Level; Pins: 2; Max Operating Temperature: 155°C; Min Operating Temperature: -55°C; Case/Package: 0402; DNP: DNP; Parameter 1: *
R22 = CMP-009-00157-2: as R5 on sheet USB; Min Operating Temperature: -55°C; Max Operating Temperature: 155°C; Pins: 2; Case/Package: 0402
R25 = CMP-009-00067-1: 10R 0.063W 1% 0402 (1005 Metric)  SMD; Power: 63mW; Mounting Technology: SMT; Pins: 2; Tolerance: 1%; Case/Package: 0402; JLCPCB Part #: C25077
R26-R28 = CMP-009-00148-2: Max Operating Temperature: 155°C; Pins: 2; Case/Package: 0402; Min Operating Temperature: -55°C
  R27 R28: DNP: DNP
TP1 = CMP-00028-00002-1: 0.6mm round; Pins: 1
U6 = CMP-010-00031-1: GPS RF Receiver BeiDou, Galileo, GLONASS, GNSS, GPS 1.575GHz -167dBm

## Sheet Altimeter.SchDoc
size B; SheetNumber: 5; SheetTotal: 8
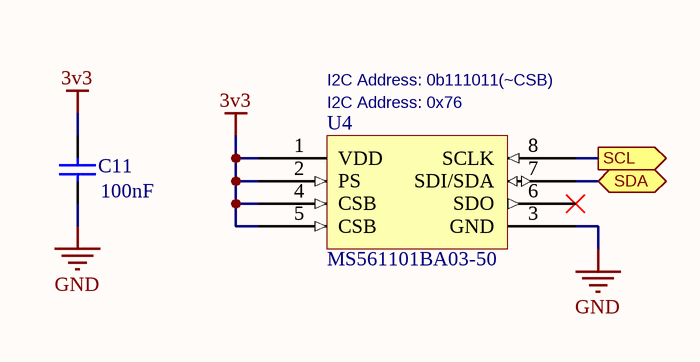
[diagram p6: Altimeter.SchDoc]

### Parts
C11  Capacitance: 100nF  [Capacitor_0402]  (hidden comment: GRM155R71E104KE14D)
U4  MS561101BA03-50  [MS561101BA03-50-Footprint-1]

### Ports
SCL (out), SDA (bidir)

### Nets
3v3: C11.2 U4.1(VDD) U4.2(PS) U4.4(CSB) U4.5(CSB)
GND: C11.1 U4.3(GND)
SCL: U4.8(SCLK) ; port SCL
SDA: U4.7(SDI/SDA) ; port SDA

Not connected (* = marked no-connect by the designer): U4 6(SDO)*

### Notes on the sheet
- (near U4) I2C Address: 0b111011(~CSB)
- (near U4) I2C Address: 0x76

### Library data of the parts
C11 = CMP-001-00084-3: Chip Capacitor 100nF 0402 25V X7R
U4 = CMP-010-00029-1: Pressure Sensor 1.44V to 3.6V 0.01bar to 1.2bar Absolute 8-Pin QFN T/R

## Sheet Regulators.SchDoc
size B; SheetNumber: 8; SheetTotal: 8
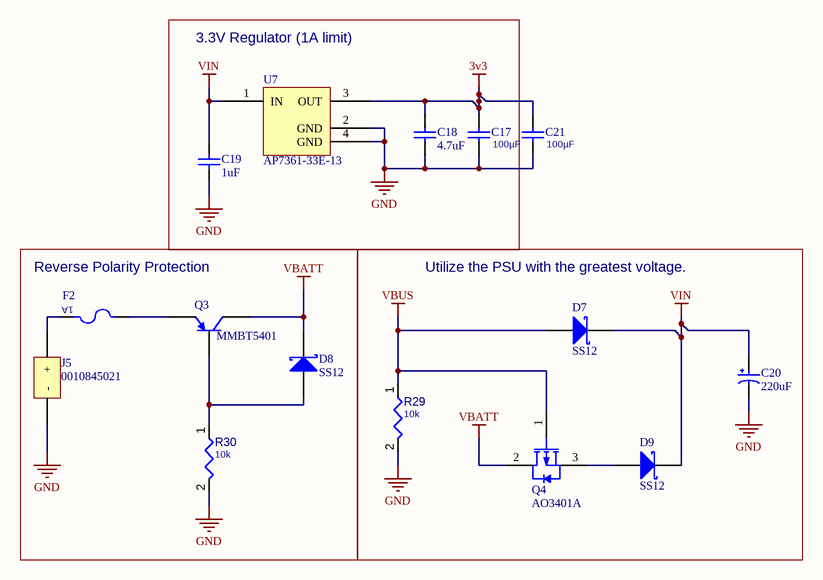
[diagram p7: Regulators.SchDoc]

### Parts
C17  value 100µF  [Capacitor_1206]  (hidden comment: CL31A107MQHNNNE)
C18  Capacitance: 4.7uF  [Capacitor_0402]  (hidden comment: GRM155R60J475ME87D)
C19  Capacitance: 1uF  [Capacitor_0402]  (hidden comment: GRM155R61E105KA12D)
C20  Capacitance: 220uF  [CASE-D_7343]  (hidden comment: T491D227K010AT)
C21  value 100µF  [Capacitor_1206]  (hidden comment: CL31A107MQHNNNE)
D7  SS12  [FAIR-DO-214AC-2_V]
D8  SS12  [FAIR-DO-214AC-2_V]
D9  SS12  [FAIR-DO-214AC-2_V]
F2  0466001.NRHF  [FP-0466-MFG]  (value not drawn)
J5  0010845021  [0010845021-Footprint-1]
Q3  MMBT5401  [SOT223127P600-8N]
Q4  AO3401A  [AO-SOT-23-3L_V]
R29  value 10k  [RESC0402(1005)_L]  (hidden comment: Resistor 10K  +/-1 % 0402 63 mW)
R30  value 10k  [RESC0402(1005)_L]  (hidden comment: Resistor 10K  +/-1 % 0402 63 mW)
U7  AP7361-33E-13  [AP7361-33E-13-Footprint-1]

### Blocks framed on the sheet
3.3V Regulator (1A limit): C17-C19 U7
Reverse Polarity Protection: D8 F2 J5 Q3 R30
Utilize the PSU with the greatest voltage.: C20 D7 D9 Q4 R29

### Nets
3v3: C17.2 C18.2 C21.2 U7.3(OUT)
GND: C17.1 C18.1 C19.1 C20.2 C21.1 J5.2(-) R29.2 R30.2 U7.2(GND) U7.4(GND)
VBATT: D8.2(K) Q3.3(C) Q4.2(SOURCE)
VBUS: D7.1(A) Q4.1(GATE) R29.1
VIN: C19.2 C20.1 D7.2(K) D9.2(K) U7.1(IN)
NetD8_1: D8.1(A) Q3.1(B) R30.1
NetD9_1: D9.1(A) Q4.3(DRAIN)
NetF2_1: F2.1 Q3.2(E)
NetF2_2: F2.2 J5.1(+)

### Library data of the parts
C17 C21 = CMP-001-00087-1: Ceramic Capacitor 100uF 6.3V X5R 1206
  C17: JLCPCB Part #: C15008
C18 = CMP-00000-1: as C7 on sheet USB; Thickness: 0.022inch; Min Operating Temperature: -55°C; Case Code (Metric): 1005; Depth: 0.5mm; Tolerance: 20%; Width: 0.02inch; Series: GRM; Length: 1mm; Height: 0.5mm; Lead Free: Lead Free; Dielectric: X5R; Construction: Flat; REACH SVHC: No SVHC; Mount: Surface Mount; Radiation Hardening: No; Voltage Rating: 6.3V; RoHS Compliant: Yes; Packaging: Tape and Reel; Voltage Rating (DC): 6.3V; Package Quantity: 1; Max Operating Temperature: 85°C; Case Code (Imperial): 0402
C19 = CMP-001-0229-3: Chip Capacitor 1uF - 0402 25 V ±10% Tolerance X5R Multilayer Ceramic Chip Capacitor; Voltage Rating: 25V; Height: 0.5mm; Thickness: 0.022inch; Case Code (Imperial): 0402; Dielectric: X5R; Depth: 0.5mm; Series: GRM; Package Quantity: 10000; RoHS Compliant: Yes; Weight: 0.000212oz; Width: 0.5mm; Tolerance: 10%; Material: Ceramic; Case Code (Metric): 1005; Length: 1mm; Voltage Rating (DC): 25V; REACH SVHC: No SVHC; Max Operating Temperature: 85°C; Min Operating Temperature: -55°C; Packaging: Cut Tape; Termination: SMD/SMT; Lead Free: Lead Free; Mount: Surface Mount; JLCPCB Part #: C52923
C20 = CMP-001-0230-1: Cap Tant Solid 220uF 10V D CASE 10% (7.3 X 4.3 X 2.8mm) SMD 7343-31 0.5 Ohm 125 C T/R; Life (Hours): 2000Hour; ESR (Equivalent Series Resistance): 500mR; Leakage Current: 22uA; Ripple Current: 548mA; Dissipation Factor: 8%; Polarity: Polar; Dielectric Material: Tantalum; Case Code (Imperial): 2917; Lead Free: Lead Free; Radiation Hardening: No; Construction: Flat; Height: 2.8mm; Series: T491; Features: General Purpose; Length: 7.3mm; Weight: 0.023634oz; Min Operating Temperature: -55°C; RoHS Compliant: Yes; Case Code (Metric): 7343; REACH SVHC: No SVHC; Mount: Surface Mount,PCB; Height - Seated (Max): 0.122inch; Max Operating Temperature: 125°C; Failure Rate: 0.001%; Package Quantity: 1; Voltage Rating: 10V; Tolerance: 10%; Voltage Rating (DC): 10V; Depth: 4.3mm; Width: 4.3mm; Termination: SMD/SMT; Packaging: Tape and Reel; JLCPCB Part #: C116577
D7-D9 = CMP-004-00016-1: Schottky Rectifier, 20 V, 1 A, -65 to 125 degC, 2-Pin DO-214AC, RoHS, Tape and Reel; Manufacturer: Fairchild; Peak Reverse Current: 200uA; Max Surge Current: 40A; Forward Voltage: 5dV; Case/Package: SMA; Package URL: https://www.fairchildsemi.com/package-drawings/DO/DO214AC.pdf; Mounting Technology: SM; Package Quantity: 7500; Manufacturer URL: https://www.fairchildsemi.com/; Min Operating Temperature: -65°C; Packaging: TapeandReel; Package Description: 2-Pin Surface Mount Device, Body 4.375 x 2.725 mm; Datasheet Version: Rev. 1.9, 01/2015; Datasheet URL: https://www.fairchildsemi.com/datasheets/SS/SS12.pdf; Package Reference: DO-214AC-2; RoHS Compliant: True; Pins: 2; Max Operating Temperature: 125°C
  D7: JLCPCB Part #: C353243
F2 = CMP-007-00037-2: as F1 on sheet GPS; Value: 1A
J5 = CMP-002-00077-1: Header Connector, pcb Mount, plug, 2 Contacts, skt, 0.25 Pitch, pc Tail Terminal, polarized Lck
Q3 = CMP-013-00036-1: Bipolar Transistor, PNP, 150V, 300mW, SOT-23, 150V, 600mA; Type: PNP; Power Dissipation (Pd): 300mW; Collector-Emitter Breakdown Voltage: 150V; Parameter 2: *; JLCPCB Part #: C8326
Q4 = CMP-013-00037-3: Trans Mosfet P-ch 30V 4A 3-PIN SOT-23 T/r; JLCPCB Part #: C15127
R29 R30 = CMP-009-00149-2: as R1 on sheet Top Level; Pins: 2; Max Operating Temperature: 155°C; Min Operating Temperature: -55°C; Case/Package: 0402
U7 = CMP-019-00051-1: AP7361 Series 3.3 V 1 A Low SMT Dropout Fixed-Mode Regulator - SOT-223

## Nets that join several sheets
3v3: Top Level (J1.2 R1.1 R2.1), USB (6 pins), Flash (C9.2 C10.2 U3.8), MCU (C3.2 C4.2 R3.1 U1.2), Accelerometer (6 pins), GPS (6 pins), Altimeter (5 pins), Regulators (C17.2 C18.2 C21.2 U7.3)
GND: Top Level (J1.19 J1.20), USB (20 pins), Flash (C9.1 C10.1 U3.4), MCU (11 pins), Accelerometer (8 pins), GPS (16 pins), Altimeter (C11.1 U4.3), Regulators (10 pins)
VBUS: USB (7 pins), GPS (D4.2 J4.1), Regulators (D7.1 Q4.1 R29.1)
VIN: Top Level (J1.1), Regulators (5 pins)
EN: USB (Q1.3), MCU (U1.26)
FLASH_HLD: Flash (U3.7), MCU (U1.33)
HSPI_CLK: Top Level (J1.10), MCU (U1.13), GPS (R23.2 R27.1)
HSPI_CS0: Top Level (J1.16), MCU (U1.23), GPS (R24.2 R28.1)
HSPI_MISO: Top Level (J1.11), MCU (U1.14), GPS (R21.2)
HSPI_MOSI: Top Level (J1.12), MCU (U1.16), GPS (R19.2)
HSPI_WP: Top Level (J1.15), MCU (U1.24)
INT_1: MCU (U1.28), Accelerometer (U5.11)
INT_2: MCU (U1.27), Accelerometer (U5.9)
IO0: USB (Q2.2), MCU (C1.1 SW1.4 U1.25)
IO25: Top Level (J1.7), MCU (U1.10)
IO26: Top Level (J1.8), MCU (U1.11)
IO27: Top Level (J1.9), MCU (U1.12)
IO32: Top Level (J1.5), MCU (U1.8)
IO33: Top Level (J1.6), MCU (U1.9)
IO34: Top Level (J1.3), MCU (U1.6)
IO35: Top Level (J1.4), MCU (U1.7)
RXD0: Top Level (J1.18), USB (P1.4 R12.1), MCU (U1.34)
SCL: Top Level (J1.14 R2.2), MCU (U1.22), Accelerometer (U5.4), GPS (R27.2), Altimeter (U4.8)
SDA: Top Level (J1.13 R1.2), MCU (U1.21), Accelerometer (U5.6), GPS (R28.2), Altimeter (U4.7)
TXD0: Top Level (J1.17), USB (P1.3 R10.1), MCU (U1.35)
VSPI_CLK: Flash (U3.6), MCU (U1.30)
VSPI_CS0: Flash (U3.1), MCU (U1.29)
VSPI_MISO: Flash (U3.2), MCU (U1.31)
VSPI_MOSI: Flash (U3.5), MCU (U1.37)
VSPI_WP: Flash (U3.3), MCU (U1.36)

## Assembly variants
DNP: not fitted J1 J5 P1 R11 R17 R29 R30 SW1 SW2 U1 U2 U3 U4 U5 U6 U7